# Altium schematic sheet Serializer.SchDoc: =ProjectTitle
size A3; SheetNumber: 15; SheetTotal: 19
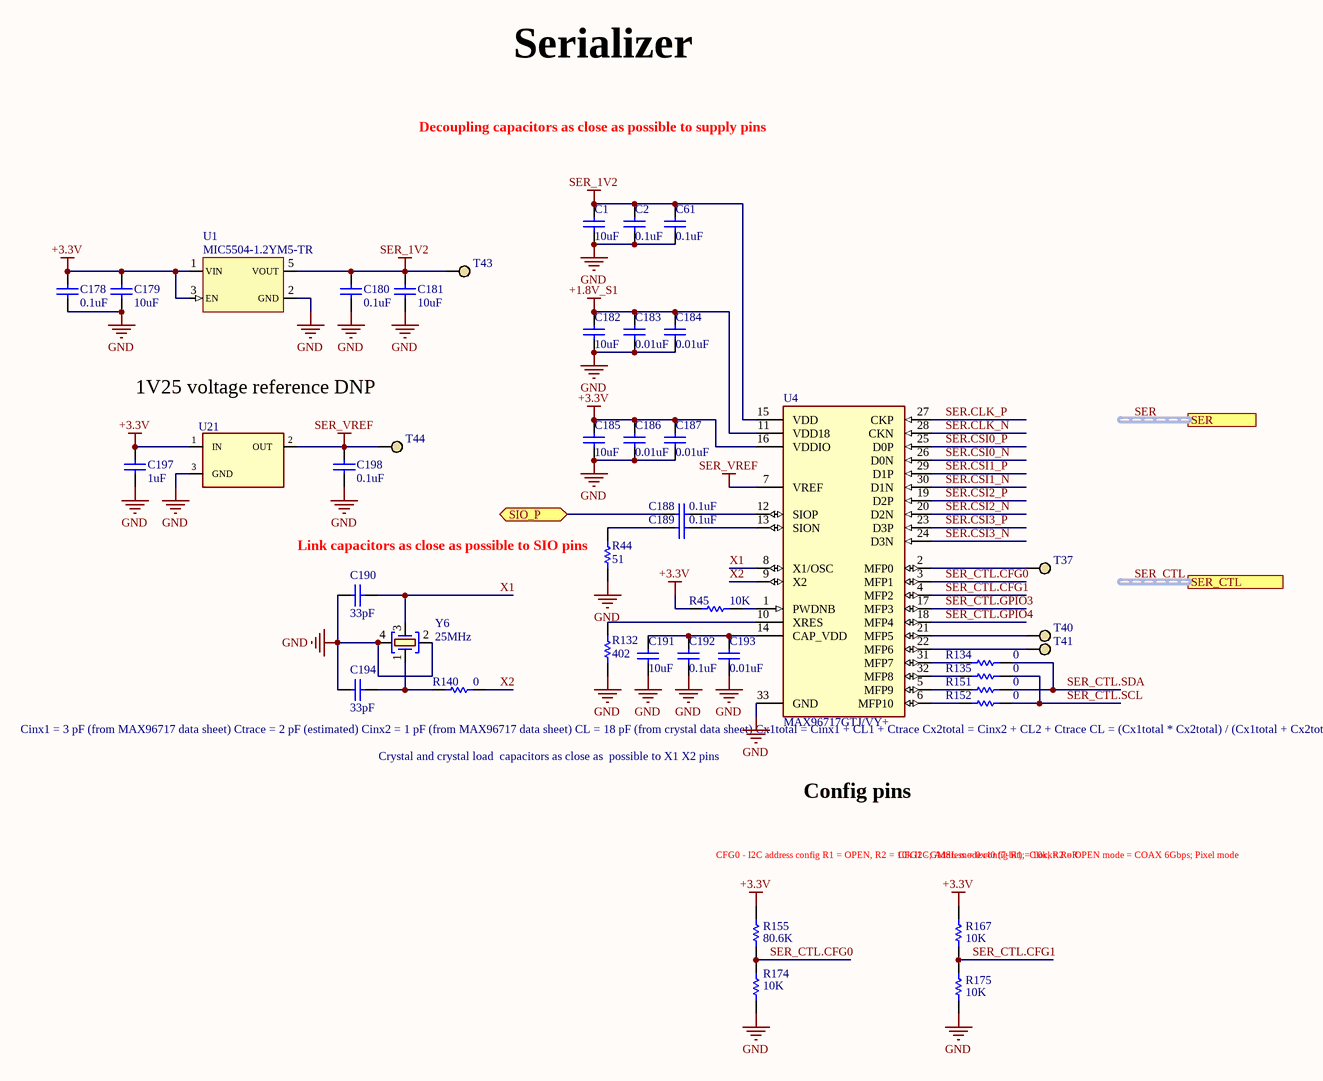
[diagram p0: Serializer.SchDoc]

## Parts
C1  10uF  [CAPC1005X55USR]
C2  0.1uF  [CAPC1005X55USR]
C61  0.1uF  [CAPC1005X55USR]
C178  0.1uF  [CAPC1005X55USR]
C179  10uF  [CAPC1608X90N]
C180  0.1uF  [CAPC1005X55USR]
C181  10uF  [CAPC1608X90N]
C182  10uF  [CAPC1005X55USR]
C183  0.01uF  [CAPC1005X55USR]
C184  0.01uF  [CAPC1005X55USR]
C185  10uF  [CAPC1005X55USR]
C186  0.01uF  [CAPC1005X55USR]
C187  0.01uF  [CAPC1005X55USR]
C188  0.1uF  [CAPC1005X55USR]
C189  0.1uF  [CAPC1005X55USR]
C190  33pF  [CAPC1005X55USR]
C191  10uF  [CAPC1005X55USR]
C192  0.1uF  [CAPC1005X55USR]
C193  0.01uF  [CAPC1005X55USR]
C194  33pF  [CAPC1005X55USR]
C197  1uF  [CAPC1005X55USR]
C198  0.1uF  [CAPC1005X55USR]
R44  51  [RESC1005X40USR]
R45  10K  [RESC1005X40USR]
R132  402  [RESC1005X40USR]
R134  0  [RESC1005X40USR]
R135  0  [RESC1005X40USR]
R140  0  [RESC1005X40USR]
R151  0  [RESC1005X40USR]
R152  0  [RESC1005X40USR]
R155  80.6K  [RESC1005X40USR]
R167  10K  [RESC1005X40USR]
R174  10K  [RESC1005X40USR]
R175  10K  [RESC1005X40USR]
T37  TP_S  [TP 1mm]  (value not drawn)  (no BOM)
T40  TP_S  [TP 1mm]  (value not drawn)  (no BOM)
T41  TP_S  [TP 1mm]  (value not drawn)  (no BOM)
T43  TP_S  [TP 1mm]  (value not drawn)  (no BOM)
T44  TP_S  [TP 1mm]  (value not drawn)  (no BOM)
U1  MIC5504-1.2YM5-TR  [SOT23-5]
U4  MAX96717GTJ/VY+  [QFN50P500X500X80-33N]
U21  REF3012AIDBZT  [SOT-23]  (value not drawn)
Y6  25MHz  [XTAL_ABM8G_3225]

## Ports
SER (harness MIPI), SER_CTL (harness SER_CTRL), SIO_P (bidir)

## Nets
+1.8V_S1: C182.2 C183.2 C184.2 U4.11(VDD18)
+3.3V: C178.2 C179.2 C185.2 C186.2 C187.2 C197.2 R45.2 R155.2 R167.2 U1.1(VIN) U1.3(EN) U4.16(VDDIO) U21.1(IN)
GND: C1.1 C2.2 C61.2 C178.1 C179.1 C180.1 C181.1 C182.1 C183.1 C184.1 C185.1 C186.1 C187.1 C190.1 C191.1 C192.2 C193.1 C194.1 C197.1 C198.1 R44.1 R132.1 R174.1 R175.1 U1.2(GND) U4.33(GND) U21.3(GND) Y6.2(SH) Y6.4(SH)
SER_1V2: C1.2 C2.1 C61.1 C180.2 C181.2 T43.1 U1.5(VOUT) U4.15(VDD)
SER_VREF: C198.2 T44.1 U4.7(VREF) U21.2(OUT)
SER.CLK_N: U4.28(CKN)
SER.CLK_P: U4.27(CKP)
SER.CSI0_N: U4.26(D0N)
SER.CSI0_P: U4.25(D0P)
SER.CSI1_N: U4.30(D1N)
SER.CSI1_P: U4.29(D1P)
SER.CSI2_N: U4.20(D2N)
SER.CSI2_P: U4.19(D2P)
SER.CSI3_N: U4.24(D3N)
SER.CSI3_P: U4.23(D3P)
SER_CTL.CFG0: R155.1 R174.2 U4.3(MFP1)
SER_CTL.CFG1: R167.1 R175.2 U4.4(MFP2)
SER_CTL.GPIO3: U4.17(MFP3)
SER_CTL.GPIO4: U4.18(MFP4)
SER_CTL.SCL: R135.2 R152.2
SER_CTL.SDA: R134.2 R151.2
SIO_P: C188.1 ; port SIO_P
X1: C190.2 U4.8(X1/OSC) Y6.3
X2: R140.2 U4.9(X2)
NetC188_2: C188.2 U4.12(SIOP)
NetC189_1: C189.1 R44.2
NetC189_2: C189.2 U4.13(SION)
NetC191_2: C191.2 C192.1 C193.2 U4.14(CAP_VDD)
NetC194_2: C194.2 R140.1 Y6.1
NetR45_1: R45.1 U4.1(PWDNB)
NetR132_2: R132.2 U4.10(XRES)
NetR134_1: R134.1 U4.31(MFP7)
NetR135_1: R135.1 U4.32(MFP8)
NetR151_1: R151.1 U4.5(MFP9)
NetR152_1: R152.1 U4.6(MFP10)
NetT37_1: T37.1 U4.2(MFP0)
NetT40_1: T40.1 U4.21(MFP5)
NetT41_1: T41.1 U4.22(MFP6)

## Buses and harness runs
harness SER = port SER
harness SER_CTL = port SER_CTL

## Notes on the sheet
- Serializer
- Decoupling capacitors as close as possible to supply pins
- 1V25 voltage reference DNP
- (near R44) Link capacitors as close as possible to SIO pins
- Cinx1 = 3 pF (from MAX96717 data sheet)
  Ctrace = 2 pF (estimated)
  Cinx2 = 1 pF (from MAX96717 data sheet)
  CL = 18 pF (from crystal data sheet)
  Cx1total = Cinx1 + CL1 + Ctrace
  Cx2total = Cinx2 + CL2 + Ctrace
  CL = (Cx1total * Cx2total) / (Cx1total + Cx2total)
  CL1 = 33 pF
  Cl2 = 33 pF
  CX1total = 38 pF
  Cx2total = 36 pF
  CL = 18.5 pF (meets the requirements)
- Crystal and crystal load
  capacitors as close as
  possible to X1 X2 pins
- Config pins
- CFG0 - I2C address config
  R1 = OPEN, R2 = 10k
  I2C; Address = 0x40 (7-bit);
  Clock= RoR
- CFG1 - GMSL mode config
  R1 = 10k, R2 = OPEN
  mode = COAX 6Gbps; Pixel mode
- Title
- Size:
- Date:
- A3
- Number:
- Time:
- Revision:
- Sheet
- of

## Library data of the parts
C1 C182 C185 C191 = CAP CER 10UF 10V X5R 0402: Manufacturer Part Number: CL05A106MP8NUB8; Manufacturer: Samsung Electro-Mechanics; Part #: E-CAP-042; Supplier Part Number 1: 1276-6830-2-ND; Package: 0402; value: 10uF; Supplier 1: Digi-Key; Height: 0.9mm; ComponentLink1Description: New link; ComponentLink1URL: *
C2 C61 C188 C189 C192 = CAP CER 0.1UF 25V X5R 0402: Manufacturer Part Number: CL05A104KA5NNNC; Manufacturer: Samsung Electro-Mechanics; Supplier Part Number 1: 1276-1043-1-ND; Package: 0402; Height: 0.55mm; Supplier 1: Digi-Key; value: 0.1uF
C178 C180 C198 = 0402C_0.1UF_25V_10%_X7R: CAP CER 0.1UF 25V X7R 0402; Manufacturer: AVX; Manufacturer Part Number: 04023C104KAT2A; Unit Cost, Qty 1: $0.12; Unit Cost, Qty 500: $0.02758; Value: 0.1uF
C179 C181 = 0603C_10UF_10V_20%_X5R: CAP CER 10UF 10V X5R 0603; Manufacturer: Taiyo Yuden; Manufacturer Part Number: LMK107BBJ106MALT; Component Description: 10 µF ±20% 10V Ceramic Capacitor X5R 0603; Unit Cost, Qty 1: $0.18; Unit Cost, Qty 500: 0.04188; Value: 10uF
C183 C184 C186 C187 C193 = CAP CER 0.01uF 50V X7R 0402: CAP CER 10000PF 50V X7R 0402; Manufacturer Part Number: GCM155R71H103KA55D; Manufacturer: Murata Electronics; Supplier Part Number 1: 490-4762-1-ND; Package: 0402; Height: 0.55mm; Supplier 1: Digi-Key; value: 0.01uF
C190 C194 = CAP CER 33PF 50V C0G/NP0 0402: Manufacturer Part Number: GRM1555C1H330JA01D; Manufacturer: Murata Electronics; Part #: E-CAP-042; Supplier Part Number 1: 490-5936-1-ND; Package: 0402; Height: 0.55mm; Supplier 1: Digi-Key; value: 33pF
C197 = CAP CER 1UF 10V X5R 0402: Manufacturer Part Number: CL05A105MP5NNNC; Manufacturer: Samsung Electro-Mechanics; Part #: E-CAP-042; Supplier Part Number 1: 1276-1448-1-ND; Package: 0402; value: 1uF; Supplier 1: Digi-Key; Height: 0.55mm; ComponentLink1Description: New link; ComponentLink1URL: *
R44 = RES 51 OHM 1% 1/16W 0402: Manufacturer Part Number: RC0402FR-0751RL; Manufacturer: YAGEO; Supplier Part Number 1: 311-51.0LRCT-ND; Supplier 1: Digi-Key; Height: 0.4mm; Package: 0402; value: 51
R45 R167 R174 R175 = RES 10K OHM 1% 1/16W 0402: Manufacturer: YAGEO; Manufacturer Part Number: RC0402FR-0710KL; Supplier Part Number 1: 311-10.0KLRCT-ND; Package: 0402; Height: 0.4mm; Supplier 1: Digi-Key; value: 10K
  R45: Tolerance: ±1%
R132 = RES 402 OHM 1% 1/16W 0402: Manufacturer Part Number: RC0402FR-07402RL; Manufacturer: YAGEO; Supplier Part Number 1: YAG3152CT-ND; Supplier 1: Digi-Key; Height: 0.4mm; Package: 0402; value: 402
R134 R135 R140 R151 R152 = RES 0 OHM JUMPER 1/16W 0402: Manufacturer: Yageo; Manufacturer Part Number: RC0402JR-070RL; Supplier Part Number 1: 311-0.0JRTR-ND; Package: 0402; Height: 0.4mm; Supplier 1: Digi-Key; value: 0
R155 = RES 80.6K OHM 1% 1/16W 0402: Manufacturer: YAGEO; Manufacturer Part Number: RC0402FR-0780K6L; value: 80.6K; Supplier Part Number 1: 311-80.6KLRCT-ND; Supplier 1: Digi-Key; Height: 0.4mm; Package: 0402
T37 T40 T41 T43 T44 = Test point PAD: test point
U1 = MIC550x: IC REG LINEAR 1.2V 300MA SOT23-5; Manufacturer: Microchip; Dropout Voltage: 160mV; Number of Regulators: 1; Min Current Limit: 400mA; Supplier 1: Digikey; Supplier Part Number 1: 576-4878-1-ND; Manufacturer Part Number: MIC5504-1.2YM5-TR; RoHS: Yes; Category: Voltage Regulators - Linear; Stock 1: 9823; Pricing 1: 1=0.16000, 25=0.12000, 100=0.11000 (USD); Mount: Surface Mount; Case/Package: SOT-23-5; Min Operating Temperature: -40°C; Max Operating Temperature: 125°C; Packaging: Cut Tape; Output Voltage: 1.2V; Output Current: 300mA; Series: -; RoHS Compliant: Yes; ComponentLink1URL: http://www.microchip.com/mymicrochip/filehandler.aspx?ddocname=en580292&src-supplier=Digikey; ComponentLink1Description: http://www.microchip.com/mymicrochip/filehandler.aspx?ddocname=en580292&src-supplier=Digikey; ComponentLink2URL: https://datasheet.octopart.com/MIC5504-1.2YM5-TR-Microchip-datasheet-137404938.pdf?src-supplier=Future+Electronics; ComponentLink2Description: https://datasheet.octopart.com/MIC5504-1.2YM5-TR-Microchip-datasheet-137404938.pdf?src-supplier=Future+Electronics; ComponentLink3URL: https://datasheet.octopart.com/MIC5504-1.2YM5-TR-Microchip-datasheet-137453438.pdf?src-supplier=Master+Electronics; ComponentLink3Description: https://datasheet.octopart.com/MIC5504-1.2YM5-TR-Microchip-datasheet-137453438.pdf?src-supplier=Master+Electronics
U4 = MAX96717GTJ/VY+: GMSL2 Compact Serializer; Manufacturer: Maxim; Supplier 1: Digikey; Supplier Part Number 1: 505-MAX96717GTJ/VY+-ND; Manufacturer Part Number: MAX96717GTJ/VY+; RoHS: No; Stock: 259; Pricing: 1=15.02, 10=10.718, 25=9.6132, 80=8.54788, 230=7.82974, 490=7.42722, 980=7.3625 (USD)
U21 = REF3012AIDBZT: 1.25V 50ppm/Degrees C, 50uA in SOT23-3 Series (Bandgap) Voltage Reference 3-SOT-23 -40 to 125; Manufacturer: Texas Instruments; Max Supply Voltage: 5.5V; Max Output current: 25mA; Min Input Voltage: 1.8V; Tolerance: 0.2%; Temperature Coefficient: 50ppm/°C; Min Output Voltage: 1.248V; Reference Type: Series,Fixed; Supply Current: 42uA; Number of Channels: 1; Supplier 1: Digikey; Supplier Part Number 1: REF3012AIDBZTCT-ND; Manufacturer Part Number: REF3012AIDBZT; RoHS: Yes; Category: Voltage References; Stock: 4243; Pricing: 1=1.29, 10=0.94, 25=0.8516, 100=0.754, 250=0.70748, 500=0.67942, 750=0.66537, 1250=0.64981, 1750=0.6407, 2500=0.63196, 6250=0.61311, 12500=0.60176 (USD); Case/Package: SOT-23; Pins: 3; Min Operating Temperature: -40°C; Max Operating Temperature: 125°C; Packaging: Tape and Reel; Output Voltage: 1.25V; Package Quantity: 1; Quiescent Current: 50uA; Output Current: 25mA; Max Supply Current: 50uA; Reference Voltage: 1.25V; Termination: SMD/SMT; Series: -; Max Output Voltage: 1.25V; Length: 2.92mm; Width: 1.3mm; Height: 1mm; Radiation Hardening: No; Reach SVHC Compliant: No; Lead Free: Lead Free; RoHS Compliant: Yes; ComponentLink1URL: https://datasheet.ciiva.com/2007/ref3012-2007153.pdf?src-supplier=Digikey; ComponentLink1Description: https://datasheet.ciiva.com/2007/ref3012-2007153.pdf?src-supplier=Digikey; ComponentLink2URL: https://datasheet.ciiva.com/2007/ref3012-2007154.pdf?src-supplier=Digikey; ComponentLink2Description: https://datasheet.ciiva.com/2007/ref3012-2007154.pdf?src-supplier=Digikey; ComponentLink3URL: https://datasheet.ciiva.com/2007/ref3012-2007155.pdf?src-supplier=Digikey; ComponentLink3Description: https://datasheet.ciiva.com/2007/ref3012-2007155.pdf?src-supplier=Digikey; ComponentLink4URL: https://datasheet.ciiva.com/3235/ref3033-3235533.pdf?src-supplier=Avnet; ComponentLink4Description: https://datasheet.ciiva.com/3235/ref3033-3235533.pdf?src-supplier=Avnet; ComponentLink5URL: https://datasheet.ciiva.com/3235/ref3033-3235534.pdf?src-supplier=Avnet; ComponentLink5Description: https://datasheet.ciiva.com/3235/ref3033-3235534.pdf?src-supplier=Avnet
Y6 = XTAL_ABM8G-25.000MHZ-18-D2Y-T3: Crystal 25MHz ±20ppm (Tol) ±30ppm (Stability) 18pF FUND 60Ohm 4-Pin Ultra Mini-CSMD T/R; Manufacturer: Abracon; ESR (Equivalent Series Resistance): 60R; Supplier 1: Mouser; Supplier Part Number 1: 815-ABM8G2518D2YT3; Manufacturer Part Number: ABM8G-25.000MHZ-18-D2Y-T3; RoHS: Yes; Category: Crystals; Stock: 10548; Pricing: 1=0.46, 10=0.365, 50=0.365, 100=0.348, 1000=0.284, 10000=0.257 (USD); Mounting Technology: Surface Mount; Case/Package: SMD/SMT; Pins: 4; Min Operating Temperature: -40°C; Max Operating Temperature: 85°C; Package Quantity: 3000; Frequency: 25MHz; Frequency Tolerance: 20ppm; Load Capacitance: 18pF; Packaging: Tape and Reel; Tolerance: 20ppm; Frequency Stability: 30ppm; Termination: SMD/SMT; ESR: 60R; Series: ABM8G; Length: 3.2mm; Width: 2.5mm; Height: 0.039inch; Depth: 2.5mm; Radiation Hardening: No; ComponentLink1URL: https://datasheet.ciiva.com/862/abm8g-862352.pdf?src-supplier=Digikey; ComponentLink1Description: https://datasheet.ciiva.com/862/abm8g-862352.pdf?src-supplier=Digikey; ComponentLink2URL: https://datasheet.ciiva.com/3176/abm8g-3176078.pdf?src-supplier=Avnet; ComponentLink2Description: https://datasheet.ciiva.com/3176/abm8g-3176078.pdf?src-supplier=Avnet